# EasyEDA Pro project schematic.eprj

# Board PCB_PCB_Pomorodo_2026-06-03
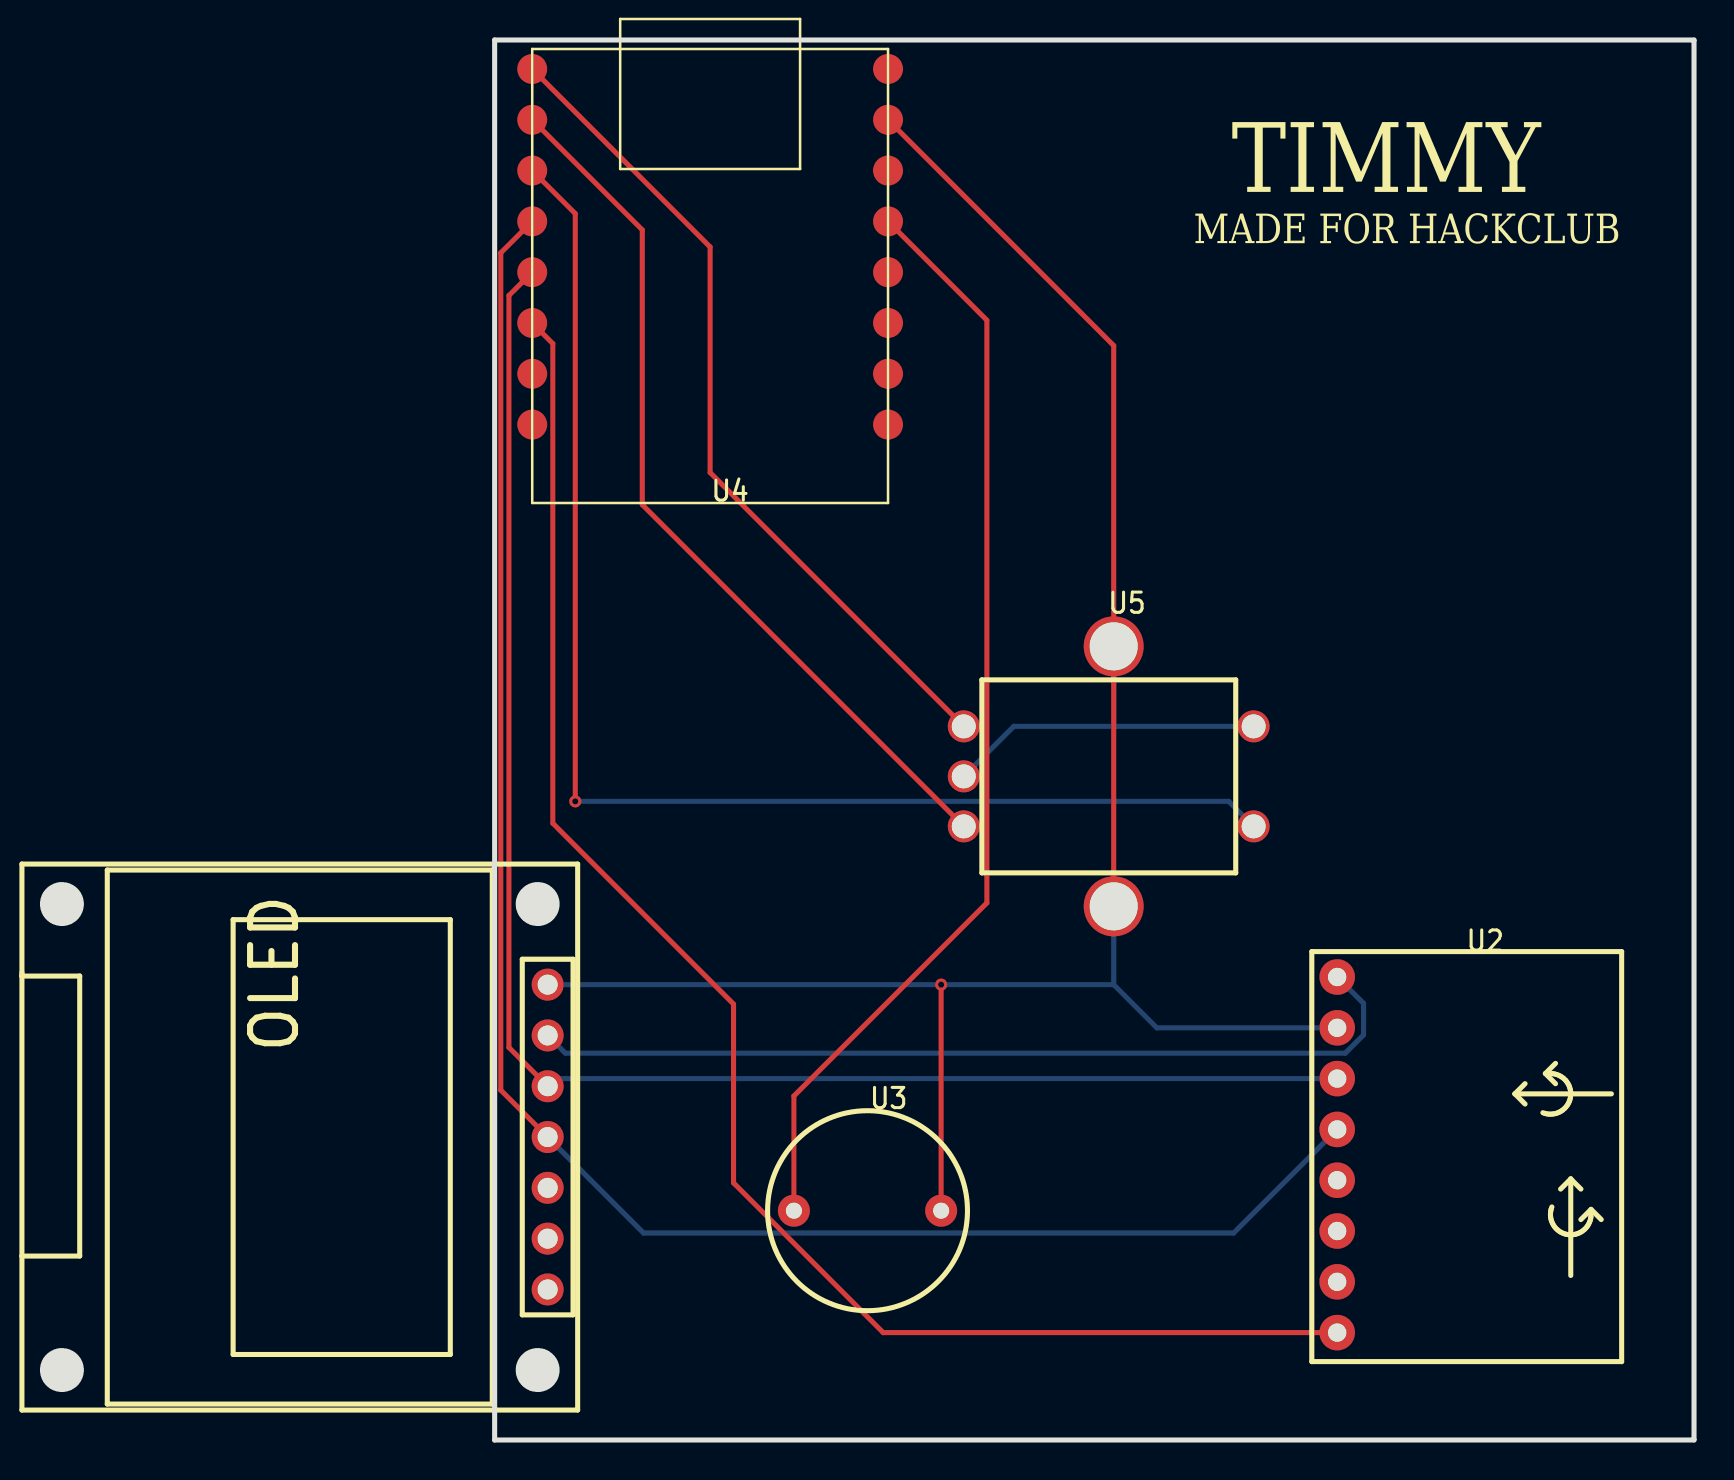
[diagram p0: board, top side]
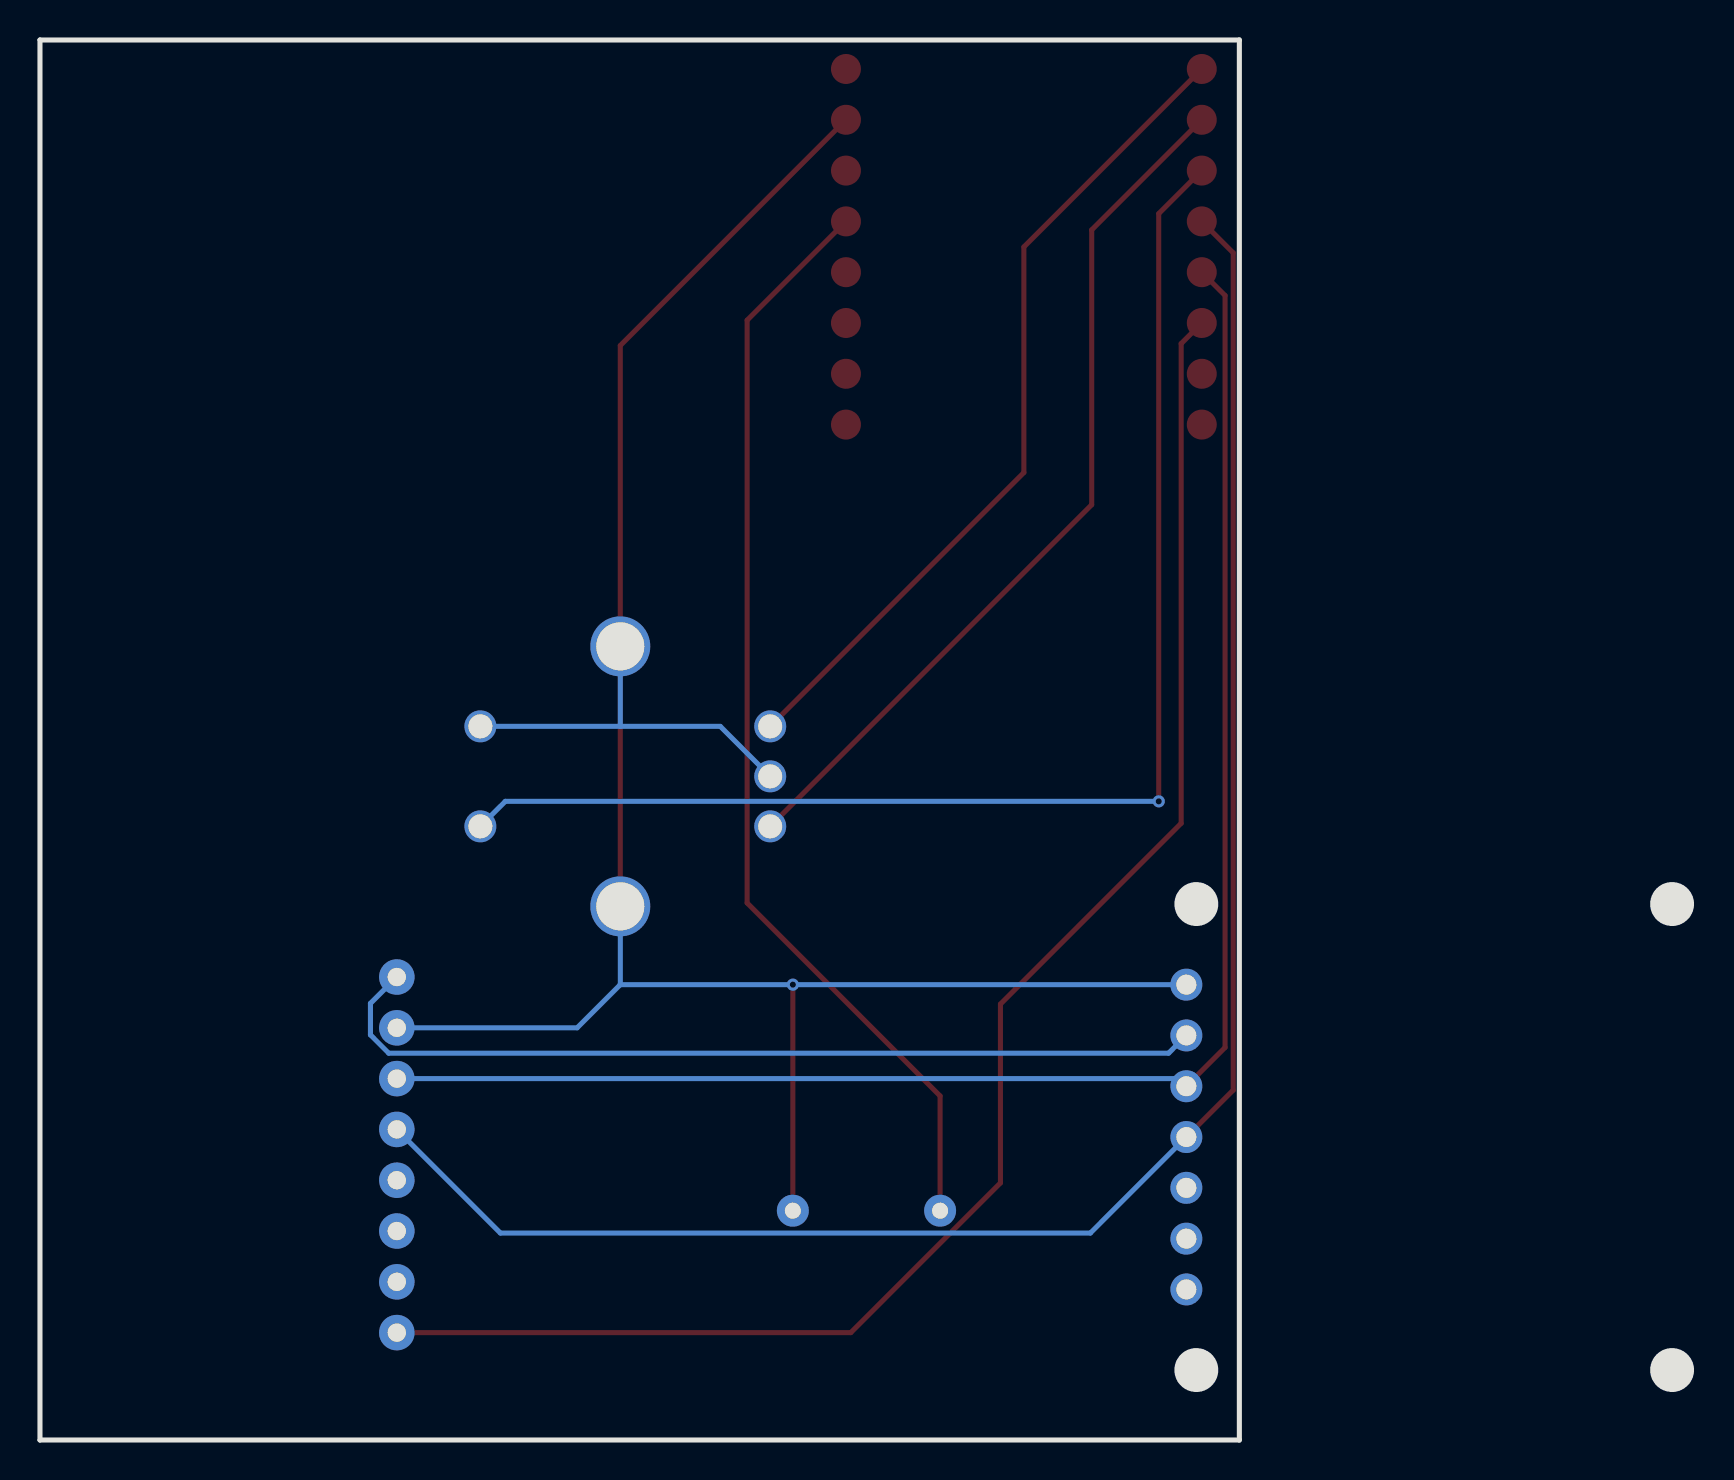
[diagram p1: board, bottom side, seen from below]

Outline 82.74 x 70 mm; copper layers: Top Layer, Bottom Layer. Coordinates in mm from the lower left corner of the outline.
Outline path: 22.74,70 82.74,70 82.74,0 22.74,0 22.74,70

## Placement (name value [footprint] x y rotation side)
OLED  -  [OLED-TH_OLED0.96-SPI]  25.4 15.15 270 top
U2  -  [MPU6050 GYROSCOPE]  64.89 14.26 0 top
U3  -  [BUZZER (10MM)]  41.4 11.47 0 top
U4  -  [ESP32-C3_SUPERMINI:MODULE_ESP32-C3_SUPERMINI]  33.52 58.2 180 top
U5  -  [EC11 ROTARY ENCODER (EC11 SET 15P5)]  53.46 33.18 0 top

## Footprints (pads in the part's own frame, mm; a bottom-side part is the same pattern mirrored in y, then rotated)
BUZZER (10MM)
  round 1.6 hole 0.8: 1(-3.683,0) 2(3.683,0)
EC11 ROTARY ENCODER (EC11 SET 15P5)
  round 1.6 hole 1.2: 1(-7.25,0) 2(7.25,2.5) 3(-7.25,2.5) 4(-7.25,-2.5) 5(7.25,-2.5)
  round 3 hole 2.4: 6(0.25,-6.5) 7(0.25,6.5)
ESP32-C3_SUPERMINI:MODULE_ESP32-C3_SUPERMINI
  round 1.5 smd: 1(8.9,-10.35) 2(8.9,-7.81) 3(8.9,-5.27) 4(8.9,-2.73) 5(8.9,-0.19) 6(8.9,2.35) 7(8.9,4.89) 8(8.9,7.43) 9(-8.9,7.43) 10(-8.9,4.89) 11(-8.9,2.35) 12(-8.9,-0.19) 13(-8.9,-2.73) 14(-8.9,-5.27) 15(-8.9,-7.81) 16(-8.9,-10.35)
MPU6050 GYROSCOPE
  round 1.778 hole 0.914: 1(0,8.89) 2(0,6.35) 3(0,3.81) 4(0,1.27) 5(0,-1.27) 6(0,-3.81) 7(0,-6.35) 8(0,-8.89)
OLED-TH_OLED0.96-SPI
  round 1.6 hole 1: 1(-7.62,0) 2(-5.08,0) 3(-2.54,0) 4(0,0) 5(2.54,0) 6(5.08,0) 7(7.62,0)

## Nets
3V3: U4.14
GND: OLED.1 U2.2 U3.2 U4.15 U5.1 U5.2 U5.6 U5.7
VCC: OLED.2 U2.1
BUZZER: U3.1 U4.13
CLK/A: U4.1 U5.3
DT/B: U4.2 U5.4
INT: U2.8 U4.6
SCL: OLED.3 U2.3 U4.5
SDA: OLED.4 U2.4 U4.4
SW: U4.3 U5.5
U2_5: U2.5
U2_6: U2.6
U2_7: U2.7
U4_7: U4.7
U4_8: U4.8
U4_9: U4.9
U4_10: U4.10
U4_11: U4.11
U4_12: U4.12
U4_16: U4.16

Pads without a net: OLED 5 6 7

## Via types
v1: diameter 0.61, hole 0.305, Top Layer to Bottom Layer, 2 vias

## Routing (per net, layer and track width the routed paths; a pad name or vN(x,y) marks a point on that pad's centre or on a via; arc(x,y) is an arc through that point)
GND: length 119.1
  Top Layer w0.254: U3.2 v1(45.08,22.77) ; U4.15 53.71,54.72 U5.7 U5.6
  Bottom Layer w0.254: U5.1 48.71,35.68 53.71,35.68 ; U2.2 55.87,20.61 53.71,22.77 ; 53.71,22.77 v1(45.08,22.77) OLED.1 ; 53.71,22.77 U5.6 ; U5.7 53.71,35.68 ; 53.71,35.68 U5.2
VCC: length 45
  Bottom Layer w0.254: OLED.2 26.29,19.34 65.29,19.34 66.21,20.26 66.21,21.83 U2.1
BUZZER: length 55.5
  Top Layer w0.254: U3.1 37.72,17.2 47.37,26.85 47.37,55.99 U4.13
CLK/A: length 41.8
  Top Layer w0.254: U5.3 33.52,48.37 33.52,59.65 24.62,68.55
DT/B: length 44.3
  Top Layer w0.254: U5.4 30.13,46.76 30.13,60.5 U4.2
INT: length 80.5
  Top Layer w0.254: U4.6 25.66,54.82 25.66,30.83 34.7,21.79 34.7,12.85 42.18,5.37 U2.8
SCL: length 81.6
  Top Layer w0.254: OLED.3 23.46,19.63 23.46,57.22 24.62,58.39
  Bottom Layer w0.254: OLED.3 25.78,18.07 U2.3
SDA: length 91
  Top Layer w0.254: U4.4 23.05,59.36 23.05,17.49 OLED.4
  Bottom Layer w0.254: U2.4 59.71,10.35 30.2,10.35 OLED.4
SW: length 66.9
  Top Layer w0.254: 24.62,63.47 26.78,61.32 v1(26.78,31.93)
  Bottom Layer w0.254: U5.5 59.46,31.93 v1(26.78,31.93)

## Text on the board
Top Silkscreen Layer: MADE FOR HACKCLUB | TIMMY
